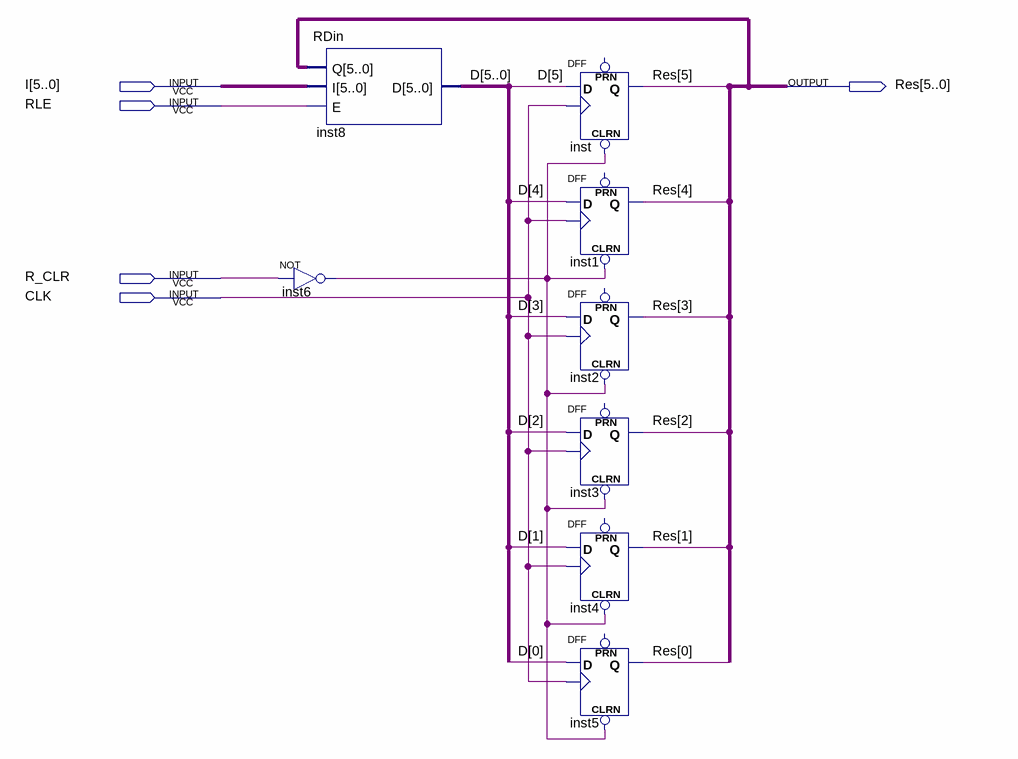
[diagram p0: schematic sheet]
// Quartus schematic Register6.bdf as structural Verilog: 8 symbols, 5 pins
module Register6 (
  input  [5:0] I,
  input  RLE,
  input  R_CLR,
  input  CLK,
  output [5:0] Res
);

  wire inst6_out;
  wire [5:0] D;

  RDin inst8 (.Q(Res), .I(I), .E(RLE), .D(D));
  not inst6 (inst6_out, R_CLR);
  DFF inst (.CLRN(inst6_out), .CLK(CLK), .D(D[5]), .Q(Res[5]));  // open: PRN
  DFF inst1 (.CLRN(inst6_out), .CLK(CLK), .D(D[4]), .Q(Res[4]));  // open: PRN
  DFF inst2 (.CLRN(inst6_out), .CLK(CLK), .D(D[3]), .Q(Res[3]));  // open: PRN
  DFF inst3 (.CLRN(inst6_out), .CLK(CLK), .D(D[2]), .Q(Res[2]));  // open: PRN
  DFF inst4 (.CLRN(inst6_out), .CLK(CLK), .D(D[1]), .Q(Res[1]));  // open: PRN
  DFF inst5 (.CLRN(inst6_out), .CLK(CLK), .D(D[0]), .Q(Res[0]));  // open: PRN
endmodule
